# Altium project PCB_Project.PrjPcb
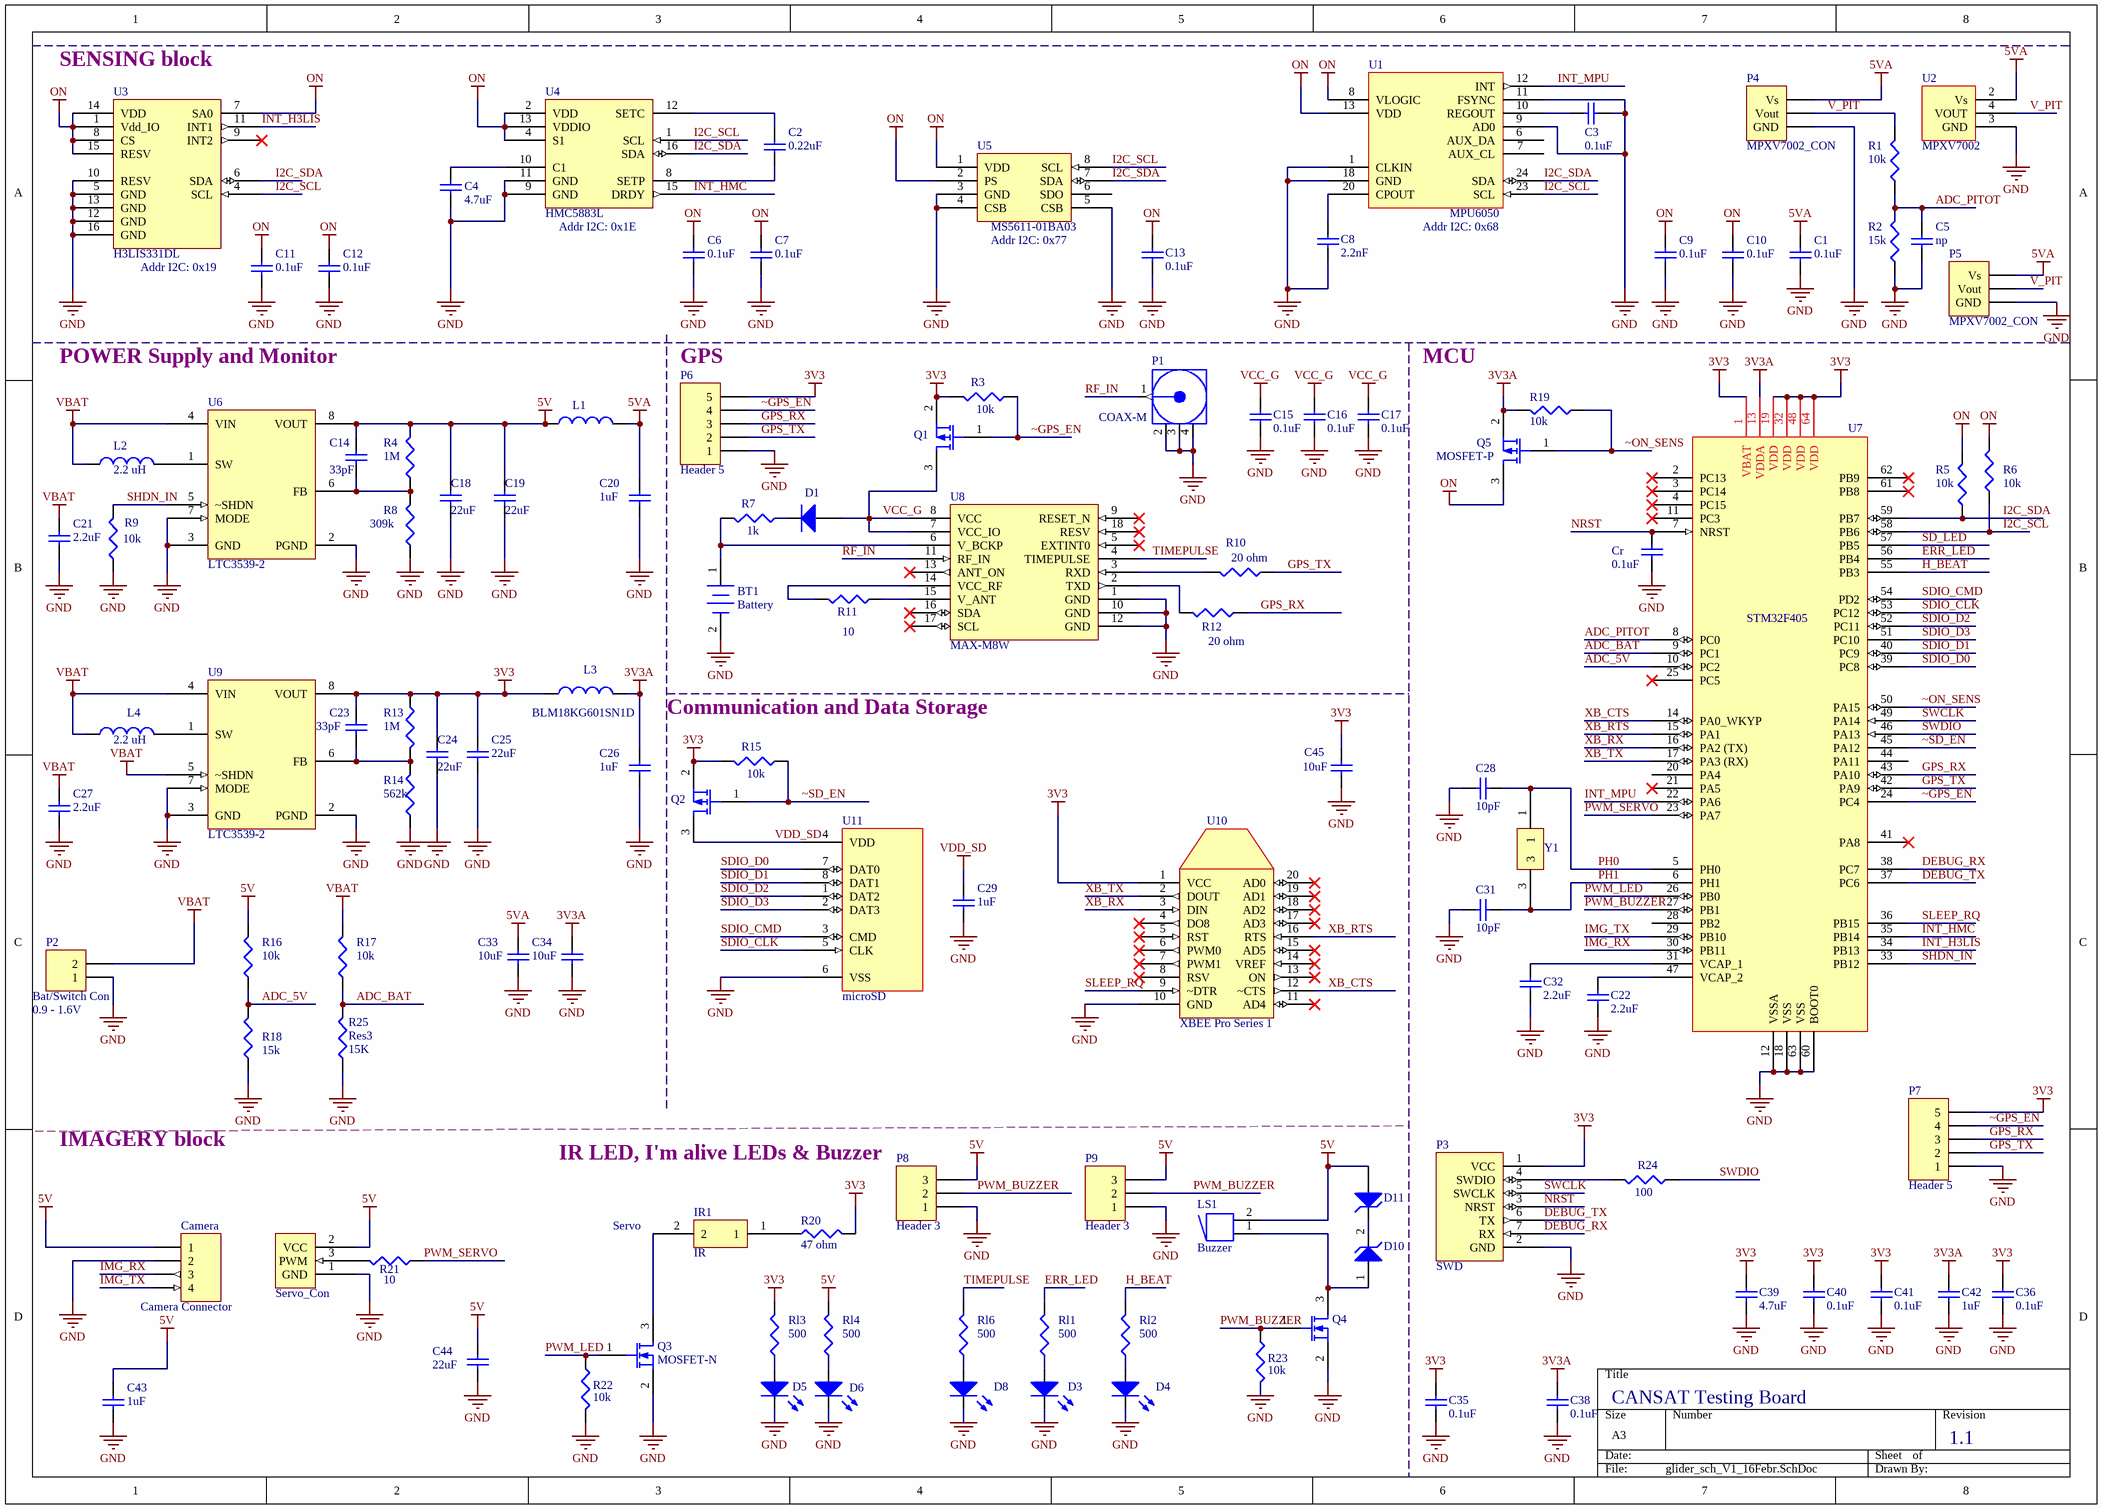
[diagram p0: glider_sch_V1_16Febr.SchDoc]
1 sheet, 117 parts. Net scope: global (net labels, ports and power ports of the same name join across sheets).
Board file: PCB1.PcbDoc

## Sheet glider_sch_V1_16Febr.SchDoc
size A3

### Parts
BT1  Battery  [Bat Antenna MS621FE-Fl11E]
C1  value 0.1uF  [CAP_0603]  (hidden comment: Cap Semi)
C2  value 0.22uF  [CAP_0603]  (hidden comment: Cap Semi)
C3  value 0.1uF  [CAP_0603]  (hidden comment: Cap Semi)
C4  value 4.7uF  [CAP_0603]  (hidden comment: Cap Semi)
C5  value np  [CAP_0603]  (hidden comment: Cap Semi)
C6  value 0.1uF  [CAP_0603]  (hidden comment: Cap Semi)
C7  value 0.1uF  [CAP_0603]  (hidden comment: Cap Semi)
C8  value 2.2nF  [CAP_0603]  (hidden comment: Cap Semi)
C9  value 0.1uF  [CAP_0603]  (hidden comment: Cap Semi)
C10  value 0.1uF  [CAP_0603]  (hidden comment: Cap Semi)
C11  value 0.1uF  [CAP_0603]  (hidden comment: Cap Semi)
C12  value 0.1uF  [CAP_0603]  (hidden comment: Cap Semi)
C13  value 0.1uF  [CAP_0603]  (hidden comment: Cap Semi)
C14  value 33pF  [CAP_0603]  (hidden comment: Cap Semi)
C15  value 0.1uF  [CAP_0603]  (hidden comment: Cap Semi)
C16  value 0.1uF  [CAP_0603]  (hidden comment: Cap Semi)
C17  value 0.1uF  [CAP_0603]  (hidden comment: Cap Semi)
C18  value 22uF  [CAP_0603]  (hidden comment: Cap Semi)
C19  value 22uF  [CAP_0603]  (hidden comment: Cap Semi)
C20  value 1uF  [CAP_0603]  (hidden comment: Cap Semi)
C21  value 2.2uF  [CAP_0603]  (hidden comment: Cap Semi)
C22  value 2.2uF  [CAP_0603]  (hidden comment: Cap Semi)
C23  value 33pF  [CAP_0603]  (hidden comment: Cap Semi)
C24  value 22uF  [CAP_0603]  (hidden comment: Cap Semi)
C25  value 22uF  [CAP_0603]  (hidden comment: Cap Semi)
C26  value 1uF  [CAP_0603]  (hidden comment: Cap Semi)
C27  value 2.2uF  [CAP_0603]  (hidden comment: Cap Semi)
C28  value 10pF  [CAP_0603]  (hidden comment: Cap Semi)
C29  value 1uF  [CAP_0603]  (hidden comment: Cap Semi)
C31  value 10pF  [CAP_0603]  (hidden comment: Cap Semi)
C32  value 2.2uF  [CAP_0603]  (hidden comment: Cap Semi)
C33  value 10uF  [CAP_0603]  (hidden comment: Cap Semi)
C34  value 10uF  [CAP_0603]  (hidden comment: Cap Semi)
C35  value 0.1uF  [CAP_0603]  (hidden comment: Cap Semi)
C36  value 0.1uF  [CAP_0603]  (hidden comment: Cap Semi)
C38  value 0.1uF  [CAP_0603]  (hidden comment: Cap Semi)
C39  value 4.7uF  [CAP_0603]  (hidden comment: Cap Semi)
C40  value 0.1uF  [CAP_0603]  (hidden comment: Cap Semi)
C41  value 0.1uF  [CAP_0603]  (hidden comment: Cap Semi)
C42  value 1uF  [CAP_0603]  (hidden comment: Cap Semi)
C43  value 1uF  [CAP_0603]  (hidden comment: Cap Semi)
C44  value 22uF  [CAP_0603]  (hidden comment: Cap Semi)
C45  value 10uF  [CAP_0603]  (hidden comment: Cap Semi)
Camera  Camera Connector  [Header 4 Camera]
Cr  value 0.1uF  [CAP_0603]  (hidden comment: Cap Semi)
D1  (no value)  [Diode(SOD-323 )]
D3  LED2  [CAP_0603]  (value not drawn)
D4  LED2  [CAP_0603]  (value not drawn)
D5  LED2  [CAP_0603]  (value not drawn)
D6  LED2  [CAP_0603]  (value not drawn)
D8  LED2  [CAP_0603]  (value not drawn)
D10  D Zener  [SOD3715X135M]  (value not drawn)
D11  D Zener  [SOD3715X135M]  (value not drawn)
IR1  IR  [Header 2 Jumper]
L1  Inductor  [INDUCTOR BLM]  (value not drawn)
L2  value 2.2 uH  [Inductor LQH55D]  (hidden comment: Inductor)
L3  value BLM18KG601SN1D  [INDUCTOR BLM]  (hidden comment: Inductor)
L4  value 2.2 uH  [Inductor LQH55D]  (hidden comment: Inductor)
LS1  Buzzer  [Buzzer]
P1  COAX-M  [SMA Connector]
P2  Bat/Switch Con  [BAT]
P3  SWD  [MOLEX_Debug_Con]
P4  MPXV7002_CON  [Header 3 Servo]
P5  MPXV7002_CON  [Header 3 Servo]
P6  Header 5  [Header 5 GPS]
P7  Header 5  [Header 5 GPS]
P8  Header 3  [Header 3 Servo]
P9  Header 3  [Header 3 Servo]
Q1  MOSFET-P  [P-MOS (SOT323)]  (value not drawn)
Q2  MOSFET-P  [P-MOS (SOT323)]  (value not drawn)
Q3  MOSFET-N  [N-MOS (SOT323)]
Q4  MOSFET-N  [P-MOS (SOT323)]  (value not drawn)
Q5  MOSFET-P  [P-MOS (SOT323)]
R1  value 10k  [RES_0603]  (hidden comment: Res3)
R2  value 15k  [RES_0603]  (hidden comment: Res3)
R3  value 10k  [RES_0603]  (hidden comment: Res3)
R4  value 1M  [RES_0603]  (hidden comment: Res3)
R5  value 10k  [RES_0603]  (hidden comment: Res3)
R6  value 10k  [RES_0603]  (hidden comment: Res3)
R7  value 1k  [RES_0603]  (hidden comment: Res3)
R8  value 309k  [RES_0603]  (hidden comment: Res3)
R9  value 10k  [RES_0603]  (hidden comment: Res3)
R10  value 20 ohm  [RES_0603]  (hidden comment: Res3)
R11  value 10  [RES_0603]  (hidden comment: Res3)
R12  value 20 ohm  [RES_0603]  (hidden comment: Res3)
R13  value 1M  [RES_0603]  (hidden comment: Res3)
R14  value 562k  [RES_0603]  (hidden comment: Res3)
R15  value 10k  [RES_0603]  (hidden comment: Res3)
R16  value 10k  [RES_0603]  (hidden comment: Res3)
R17  value 10k  [RES_0603]  (hidden comment: Res3)
R18  value 15k  [RES_0603]  (hidden comment: Res3)
R19  value 10k  [RES_0603]  (hidden comment: Res3)
R20  value 47 ohm  [RES_0603]  (hidden comment: Res3)
R21  value 10  [RES_0603]  (hidden comment: Res3)
R22  value 10k  [RES_0603]  (hidden comment: Res3)
R23  value 10k  [RES_0603]  (hidden comment: Res3)
R24  value 100  [RES_0603]  (hidden comment: Res3)
R25  Res3  value 15K  [RES_0603]
Rl1  value 500  [RES_0603]  (hidden comment: Res3)
Rl2  value 500  [RES_0603]  (hidden comment: Res3)
Rl3  value 500  [RES_0603]  (hidden comment: Res3)
Rl4  value 500  [RES_0603]  (hidden comment: Res3)
Rl6  value 500  [RES_0603]  (hidden comment: Res3)
Servo  Servo_Con  [Header 3 Servo]
U1  MPU6050  [MPU6050]
U2  MPXV7002  [SOP8_MPXV7002(Primary)]
U3  H3LIS331DL  [H3LIS_HIGH_G]
U4  HMC5883L  [HMC5883L]
U5  MS5611-01BA03  [MS561101BA03-50]
U6  LTC3539-2  [LTC3539-2]
U7  STM32F405  [Microcontroller (LQFP)]
U8  MAX-M8W  [MAX-M8W]
U9  LTC3539-2  [LTC3539-2]
U10  XBEE Pro Series 1  [XBEE DIP-20]
U11  microSD  [HIROSE_DM3DSF]
Y1  Crystal  [XTAL_TSX_3225]  (value not drawn)

### Nets
3V3: C23.2 C24.2 C25.2 C35.1 C36.1 C39.1 C40.1 C41.1 C45.1 L3.1 P3.1(VCC) P6.5 P7.5 Q1.2(S) Q2.2(S) R3.2 R13.1 R15.2 R20.2 Rl3.2 U7.1(VBAT) U7.19(VDD) U7.32(VDD) U7.48(VDD) U7.64(VDD) U9.8(VOUT) U10.1(VCC)
3V3A: C26.2 C34.2 C38.1 C42.1 L3.2 Q5.2(S) R19.2 U7.13(VDDA)
5V: C14.2 C18.2 C19.2 C43.1 C44.1 Camera.1 D11.1(A) L1.1 LS1.2 P8.3 P9.3 R4.2 R16.2 Rl4.2 Servo.2(VCC) U6.8(VOUT)
5VA: C1.1 C20.2 C33.2 L1.2 P4.3(Vs) P5.3(Vs) U2.2(Vs)
GND: BT1.2(-) C1.2 C3.2 C4.1 C5.2 C6.2 C7.2 C8.2 C9.2 C10.2 C11.2 C12.2 C13.2 C15.2 C16.2 C17.2 C18.1 C19.1 C20.1 C21.2 C22.2 C24.1 C25.1 C26.1 C27.2 C28.1 C29.2 C31.1 C32.2 C33.1 C34.1 C35.2 C36.2 C38.2 C39.2 C40.2 C41.2 C42.2 C43.2 C44.2 C45.2 Camera.2 Cr.2 D3.2(K) D4.2(K) D5.2(K) D6.2(K) D8.2(K) P1.2(GND) P1.3(GND) P1.4(GND) P2.1 P3.2(GND) P4.1(GND) P5.1(GND) P6.1 P7.1 P8.1 P9.1 Q3.2(S) Q4.2(S) R2.1 R8.1 R9.1 R14.1 R18.1 R22.2 R23.2 R25.1 Servo.1(GND) U1.1(CLKIN) U1.9(AD0) U1.11(FSYNC) U1.18(GND) U1.25(GND) U2.3(GND) U3.5(GND) U3.10(RESV) U3.12(GND) U3.13(GND) U3.16(GND) U4.9(GND) U4.11(GND) U5.3(GND) U5.4(CSB) U5.5(CSB) U6.2(PGND) U6.3(GND) U6.7(MODE) U6.9(GND) U7.12(VSSA) U7.18(VSS) U7.60(BOOT0) U7.63(VSS) U8.1(GND) U8.10(GND) U8.12(GND) U9.2(PGND) U9.3(GND) U9.7(MODE) U9.9(GND) U10.10(GND) U11.6(VSS) U11.9(GND) U11.10(GND) U11.11(GND) U11.12(GND) U11.13(GND) U11.14(GND) Y1.2 Y1.4
ON: C6.1 C7.1 C9.1 C10.1 C11.1 C12.1 C13.1 Q5.3(D) R5.2 R6.2 U1.8(VLOGIC) U1.13(VDD) U3.1(Vdd_IO) U3.7(SA0) U3.8(CS) U3.14(VDD) U3.15(RESV) U4.2(VDD) U4.4(S1) U4.13(VDDIO) U5.1(VDD) U5.2(PS)
VBAT: C21.1 C27.1 L2.1 L4.1 P2.2 R17.2 U6.4(VIN) U9.4(VIN) U9.5(~SHDN)
VCC_G: C15.1 C16.1 C17.1 D1.1(A) Q1.3(D) U8.7(VCC_IO) U8.8(VCC)
VDD_SD: C29.1 Q2.3(D) U11.4(VDD)
ADC_5V: R16.1 R18.2 U7.10(PC2)
ADC_BAT: R17.1 R25.2 U7.9(PC1)
ADC_PITOT: C5.1 R1.1 R2.2 U7.8(PC0)
DEBUG_RX: P3.7(RX) U7.38(PC7)
DEBUG_TX: P3.6(TX) U7.37(PC6)
ERR_LED: Rl1.2 U7.56(PB4)
GPS_RX: P6.3 P7.3 R12.1 U7.43(PA10)
GPS_TX: P6.2 P7.2 R10.1 U7.42(PA9)
H_BEAT: Rl2.2 U7.55(PB3)
I2C_SCL: R6.1 U1.23(SCL) U3.4(SCL) U4.1(SCL) U5.8(SCL) U7.58(PB6)
I2C_SDA: R5.1 U1.24(SDA) U3.6(SDA) U4.16(SDA) U5.7(SDA) U7.59(PB7)
IMG_RX: Camera.3 U7.30(PB11)
IMG_TX: Camera.4 U7.29(PB10)
INT_H3LIS: U3.11(INT1) U7.34(PB13)
INT_HMC: U4.15(DRDY) U7.35(PB14)
INT_MPU: U1.12(INT) U7.22(PA6)
NRST: Cr.1 P3.3(NRST) U7.7(NRST)
PH0: C28.2 U7.5(PH0) Y1.1
PH1: C31.2 U7.6(PH1) Y1.3
PWM_BUZZER: P8.2 P9.2 Q4.1(G) R23.1 U7.27(PB1)
PWM_LED: Q3.1(G) R22.1 U7.26(PB0)
PWM_SERVO: R21.1 U7.23(PA7)
RF_IN: P1.1(Signal) U8.11(RF_IN)
SD_LED: U7.57(PB5)
SDIO_CLK: U7.53(PC12) U11.5(CLK)
SDIO_CMD: U7.54(PD2) U11.3(CMD)
SDIO_D0: U7.39(PC8) U11.7(DAT0)
SDIO_D1: U7.40(PC9) U11.8(DAT1)
SDIO_D2: U7.52(PC11) U11.1(DAT2)
SDIO_D3: U7.51(PC10) U11.2(DAT3)
SHDN_IN: R9.2 U6.5(~SHDN) U7.33(PB12)
SLEEP_RQ: U7.36(PB15) U10.9(~DTR)
SWCLK: P3.5(SWCLK) U7.49(PA14)
SWDIO: R24.1 U7.46(PA13)
TIMEPULSE: Rl6.2 U8.4(TIMEPULSE)
V_PIT: P4.2(Vout) P5.2(Vout) R1.2 U2.4(VOUT)
XB_CTS: U7.14(PA0_WKYP) U10.12(~CTS)
XB_RTS: U7.15(PA1) U10.16(RTS)
XB_RX: U7.16(PA2_(TX)) U10.3(DIN)
XB_TX: U7.17(PA3_(RX)) U10.2(DOUT)
~GPS_EN: P6.4 P7.4 Q1.1(G) R3.1 U7.24(PC4)
~ON_SENS: Q5.1(G) R19.1 U7.50(PA15)
~SD_EN: Q2.1(G) R15.1 U7.45(PA12)
NetBT1_1: BT1.1(+) R7.2 U8.6(V_BCKP)
NetC2_1: C2.1 U4.8(SETP)
NetC2_2: C2.2 U4.12(SETC)
NetC3_1: C3.1 U1.10(REGOUT)
NetC4_2: C4.2 U4.10(C1)
NetC8_1: C8.1 U1.20(CPOUT)
NetC14_1: C14.1 R4.1 R8.2 U6.6(FB)
NetC22_1: C22.1 U7.47(VCAP_2)
NetC23_1: C23.1 R13.2 R14.2 U9.6(FB)
NetC32_1: C32.1 U7.31(VCAP_1)
NetD1_2: D1.2(K) R7.1
NetD3_1: D3.1(A) Rl1.1
NetD4_1: D4.1(A) Rl2.1
NetD5_1: D5.1(A) Rl3.1
NetD6_1: D6.1(A) Rl4.1
NetD8_1: D8.1(A) Rl6.1
NetD10_1: D10.1(A) LS1.1 Q4.3(D)
NetD10_2: D10.2(K) D11.2(K)
NetIR1_1: IR1.1 R20.1
NetIR1_2: IR1.2 Q3.3(D)
NetL2_2: L2.2 U6.1(SW)
NetL4_2: L4.2 U9.1(SW)
NetP3_4: P3.4(SWDIO) R24.2
NetR10_2: R10.2 U8.3(RXD)
NetR11_1: R11.1 U8.15(V_ANT)
NetR11_2: R11.2 U8.14(VCC_RF)
NetR12_2: R12.2 U8.2(TXD)
NetR21_2: R21.2 Servo.3(PWM)

Not connected (* = marked no-connect by the designer): U1 2(N/C) 3(N/C) 4(N/C) 5(N/C) 6(AUX_DA) 7(AUX_CL) 14(N/C) 15(N/C) 16(N/C) 17(N/C) 19(RESV) 21(RESV) 22(RESV); U2 1(N/C) 5(N/C) 6(N/C) 7(N/C) 8(N/C); U3 2(N/C) 3(N/C) 9(INT2)*; U4 3(N/C) 5(N/C) 6(N/C) 7(N/C) 14(N/C); U5 6(SDO); U7 2(PC13)* 3(PC14)* 4(PC15)* 11(PC3)* 20(PA4) 21(PA5)* 25(PC5)* 28(PB2) 41(PA8)* 44(PA11) 61(PB8)* 62(PB9)*; U8 5(EXTINT0)* 9(RESET_N)* 13(ANT_ON)* 16(SDA)* 17(SCL)* 18(RESV)*; U10 4(DO8)* 5(RST)* 6(PWM0)* 7(PWM1)* 8(RSV)* 11(AD4)* 13(ON)* 14(VREF)* 15(AD5)* 17(AD3)* 18(AD2)* 19(AD1)* 20(AD0)*

### Notes on the sheet
- (near U3) SENSING block
- (near U4) Addr I2C: 0x1E
- (near U5) Addr I2C: 0x77
- (near U1) Addr I2C: 0x68
- Addr I2C: 0x19
- POWER Supply and Monitor
- (near P6) GPS
- MCU
- Communication and Data Storage
- (near P2) 0.9 - 1.6V
- IMAGERY block
- (near P8) IR LED, I'm alive LEDs & Buzzer
- CANSAT Testing Board
- 1.1

### Library data of the parts
BT1 = Battery: Multicell Battery; Published: 24-Mar-1999; LatestRevisionDate: 17-Jul-2002; LatestRevisionNote: Re-released for DXP Platform.; PackageReference: BAT-2; Publisher: Altium Limited; PackageDescription: Battery; 2 Leads
C1-C29 C31-C36 C38-C45 Cr = Cap Semi: Capacitor (Semiconductor SIM Model); Published: 8-Jun-2000; LatestRevisionDate: 29-May-2009; LatestRevisionNote: IPC-7351 Footprint Added.; PackageReference: C1206; Publisher: Altium Limited; PackageDescription: Chip Capacitor
Camera = Header 4: Header, 4-Pin; LatestRevisionDate: 17-Jul-2002; LatestRevisionNote: Re-released for DXP Platform.; Publisher: Altium Limited
D1 = Diode: Default Diode; Published: 8-Jun-2000; LatestRevisionDate: 17-Jul-2002; LatestRevisionNote: Re-released for DXP Platform.; PackageVersion: Sep-1996; PackageReference: SMC; Publisher: Altium Limited; PackageDescription: DO-214-AB/SMC; 2 C-Bend Leads; Body 7.9 x 5.9 mm, inc. leads (LxW); Code_JEDEC: DO-214-AB
D3-D6 D8 = LED2: Typical RED, GREEN, YELLOW, AMBER GaAs LED; Published: 8-Jun-2000; LatestRevisionDate: 17-Jul-2002; LatestRevisionNote: Re-released for DXP Platform.; PackageVersion: Feb-2002; PackageReference: 3.2X1.6X1.1; Publisher: Altium Limited; PackageDescription: SM LED; 2 Flat Leads
D10 D11 = D Zener: Zener Diode; Published: 8-Jun-2000; LatestRevisionDate: 17-Jul-2002; LatestRevisionNote: Re-released for DXP Platform.; PackageReference: DIODE-0.7; Publisher: Altium Limited; PackageDescription: Diode, Thru-Hole; 2 Leads; 0.7 in Pin Spacing
IR1 = Res
L1 = Inductor: Code_IEC: 1005; Value: BLM18KG601SN1D; Published: 8-Jun-2000; LatestRevisionDate: 29-May-2009; LatestRevisionNote: IPC-7351 Footprint Added.; PackageReference: 0402-A; Publisher: Altium Limited; PackageDescription: Chip Inductor; Code_JEITA: 0402
L2-L4 = Inductor: Code_IEC: 1005; Published: 8-Jun-2000; LatestRevisionDate: 29-May-2009; LatestRevisionNote: IPC-7351 Footprint Added.; PackageReference: 0402-A; Publisher: Altium Limited; PackageDescription: Chip Inductor; Code_JEITA: 0402
LS1 = Buzzer: Magnetic Transducer Buzzer; Published: 24-Mar-1999; LatestRevisionDate: 17-Dec-2003; LatestRevisionNote: Schematic revised, PCB Footprint replaced.; DatasheetVersion: 17-Dec-2003; PackageReference: ABSM-1574; Publisher: Altium Limited; PackageDescription: Magnetic Transducer Buzzer; ComponentLink1Description: Manufacturer Link; ComponentLink1URL: http://www.megastar.com/linecard/buzzmode/index.php
P1 = COAX-M: RF Coaxial PCB Connector, MMCX; Thru-Hole, Vertical Mount Plug,  50 Ohm Impedance; PackageDocument: Rev. A, 16-Jun-1997; PCB_Layout: Complies with manufacturer's recommendation.; DrillSize: Corresponds to nominal value.; Published: 15-Jul-2004; LatestRevisionDate: 15-Jul-2004; LatestRevisionNote: Component Replaced.; DatasheetDocument: 30-May-2003; PackageReference: 908-21103; Publisher: Altium Limited; ComponentLink1Description: Manufacturer Link; ComponentLink1URL: http://www.amphenolrf.com/
P2 = Header 2: Header, 2-Pin; LatestRevisionDate: 17-Jul-2002; LatestRevisionNote: Re-released for DXP Platform.; Publisher: Altium Limited
P3 = SWD: Connector
P4 P5 P8 P9 = Header 3: Header, 3-Pin; LatestRevisionDate: 17-Jul-2002; LatestRevisionNote: Re-released for DXP Platform.; Publisher: Altium Limited
P6 P7 = Header 5: Header, 5-Pin; LatestRevisionDate: 17-Jul-2002; LatestRevisionNote: Re-released for DXP Platform.; Publisher: Altium Limited
Q1 Q2 Q5 = MOSFET-P: P-Channel MOSFET; Published: 8-Jun-2000; LatestRevisionDate: 17-Jul-2002; LatestRevisionNote: Re-released for DXP Platform.; PackageVersion: 1995/1996; PackageReference: E3; Publisher: Altium Limited; PackageDescription: TO, Flat Index; 3 In-Line, Axial Leads; Body Dia. 4.6mm; Lead Dia. 0.5 mm (max)
Q3 Q4 = MOSFET-N: N-Channel MOSFET; Published: 8-Jun-2000; LatestRevisionDate: 17-Jul-2002; LatestRevisionNote: Re-released for DXP Platform.; PackageVersion: 1995/1996; PackageReference: E3; Publisher: Altium Limited; PackageDescription: TO, Flat Index; 3 In-Line, Axial Leads; Body Dia. 4.6mm; Lead Dia. 0.5 mm (max)
R1-R25 Rl1-Rl4 Rl6 = Res3: Resistor; Published: 8-Jun-2000; LatestRevisionDate: 29-May-2009; LatestRevisionNote: IPC-7351 Footprint Added.; PackageReference: J1-0603; Publisher: Altium Limited; PackageDescription: Chip Resistor
Servo = Servo_Con: Header 3
U1 = MPU6050: Accelerometer (lowg)
U2 = MPXV7002: Pressure Sensor for pitot tube
U3 = H3LIS331DL: High g accelerometer
U4 = HMC5883L: Magnetometer
U5 = MS5611-01BA03: Pressure Sensor
U6 U9 = LTC3539: DCDC
U7 = STM32F405: MCU
U8 = MAX-M8: GPS
Y1 = Crystal: Quartz